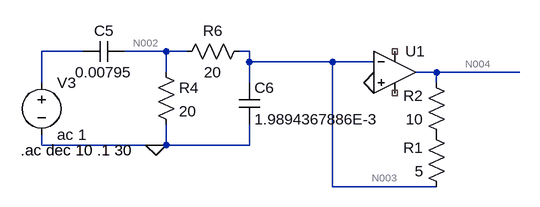
[diagram p0: schematic Prelab.asc]
Prelab.asc, the LTspice schematic file:
Version 4
SHEET 1 880 680
WIRE -1424 -32 -1488 -32
WIRE -1296 -32 -1360 -32
WIRE -1264 -32 -1296 -32
WIRE -1168 -32 -1184 -32
WIRE -1168 -16 -1168 -32
WIRE -1040 -16 -1168 -16
WIRE -976 -16 -1040 -16
WIRE -1296 0 -1296 -32
WIRE -880 0 -912 0
WIRE -752 0 -880 0
WIRE -1488 16 -1488 -32
WIRE -1168 16 -1168 -16
WIRE -880 16 -880 0
WIRE -1488 112 -1488 96
WIRE -1312 112 -1488 112
WIRE -1296 112 -1296 80
WIRE -1296 112 -1312 112
WIRE -1168 112 -1168 80
WIRE -1168 112 -1296 112
WIRE -1040 176 -1040 -16
WIRE -880 176 -1040 176
FLAG -1312 112 0
FLAG -976 16 0
SYMBOL voltage -1488 0 R0
SYMATTR InstName V3
SYMATTR Value ac 1
SYMBOL cap -1360 -48 R90
WINDOW 0 0 32 VBottom 2
WINDOW 3 32 32 VTop 2
SYMATTR InstName C5
SYMATTR Value 0.00795
SYMBOL res -1312 -16 R0
SYMATTR InstName R4
SYMATTR Value 20
SYMBOL res -1168 -48 R90
WINDOW 0 0 56 VBottom 2
WINDOW 3 32 56 VTop 2
SYMATTR InstName R6
SYMATTR Value 20
SYMBOL cap -1184 16 R0
SYMATTR InstName C6
SYMATTR Value 1.9894367886E-3
SYMBOL OpAmps\\UniversalOpamp2 -944 0 R0
SYMATTR InstName U1
SYMBOL res -864 192 R180
WINDOW 0 36 76 Left 2
WINDOW 3 36 40 Left 2
SYMATTR InstName R1
SYMATTR Value 5
SYMBOL res -864 112 R180
WINDOW 0 36 76 Left 2
WINDOW 3 36 40 Left 2
SYMATTR InstName R2
SYMATTR Value 10
TEXT -1520 120 Left 2 !.ac dec 10 .1 30

The netlist it stands for:
* Prelab.asc
V3 N001 0 ac 1
C5 N002 N001 0.00795
R4 N002 0 20
R6 N003 N002 20
C6 N003 0 1.9894367886E-3
XU1 0 N003 NC_01 NC_02 N004 level.2 Avol=1Meg GBW=10Meg Slew=10Meg ilimit=25m rail=0 Vos=0 phimargin=45 en=0 enk=0 in=0 ink=0 Rin=500Meg  ; pins IN+ IN- V+ V- OUT
R1 N003 P001 5
R2 P001 N004 10
.ac dec 10 .1 30
.lib UniversalOpamps2.sub
.backanno
.end

* Results of the author's LTspice run, read from the files saved beside the schematic
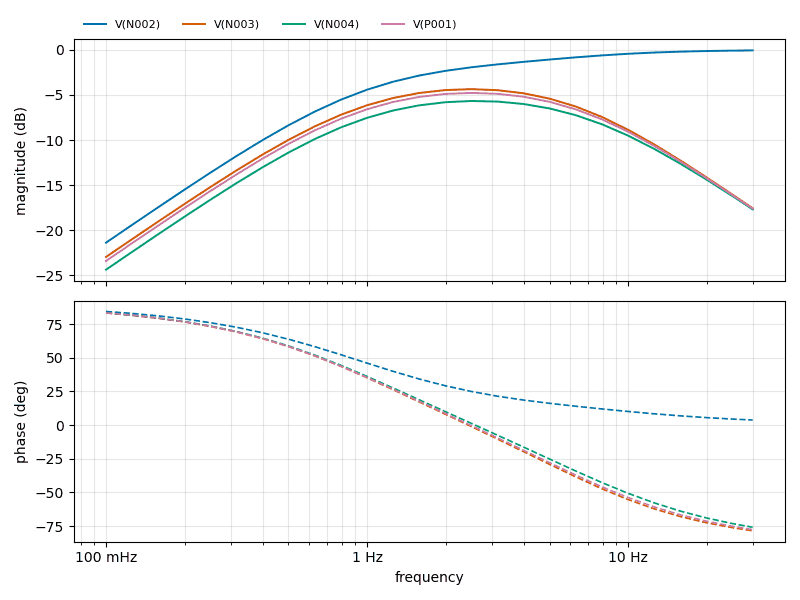
[diagram p1: AC Analysis of Prelab.asc, plotted from the saved traces]
* AC Analysis, 1 run:
*   V(N002): -21.39 dB at 100 mHz, -0.06 dB at 30 Hz, peak -0.06 dB at 30 Hz, 3 dB below the peak at 1.471 Hz
*   V(N003): -22.98 dB at 100 mHz, -17.57 dB at 30 Hz, peak -4.36 dB at 2.512 Hz, 3 dB below the peak at 770.6 mHz and 7.819 Hz
*   V(N004): -24.39 dB at 100 mHz, -17.69 dB at 30 Hz, peak -5.67 dB at 2.512 Hz, 3 dB below the peak at 782.8 mHz and 8.586 Hz
*   V(P001): -23.42 dB at 100 mHz, -17.61 dB at 30 Hz, peak -4.77 dB at 2.512 Hz, 3 dB below the peak at 774 mHz and 8.039 Hz